# Altium schematic sheet 06_SAMA7G54-DDR3.SchDoc
size 420 x 297 mm; SheetNumber: 29; SheetTotal: 29
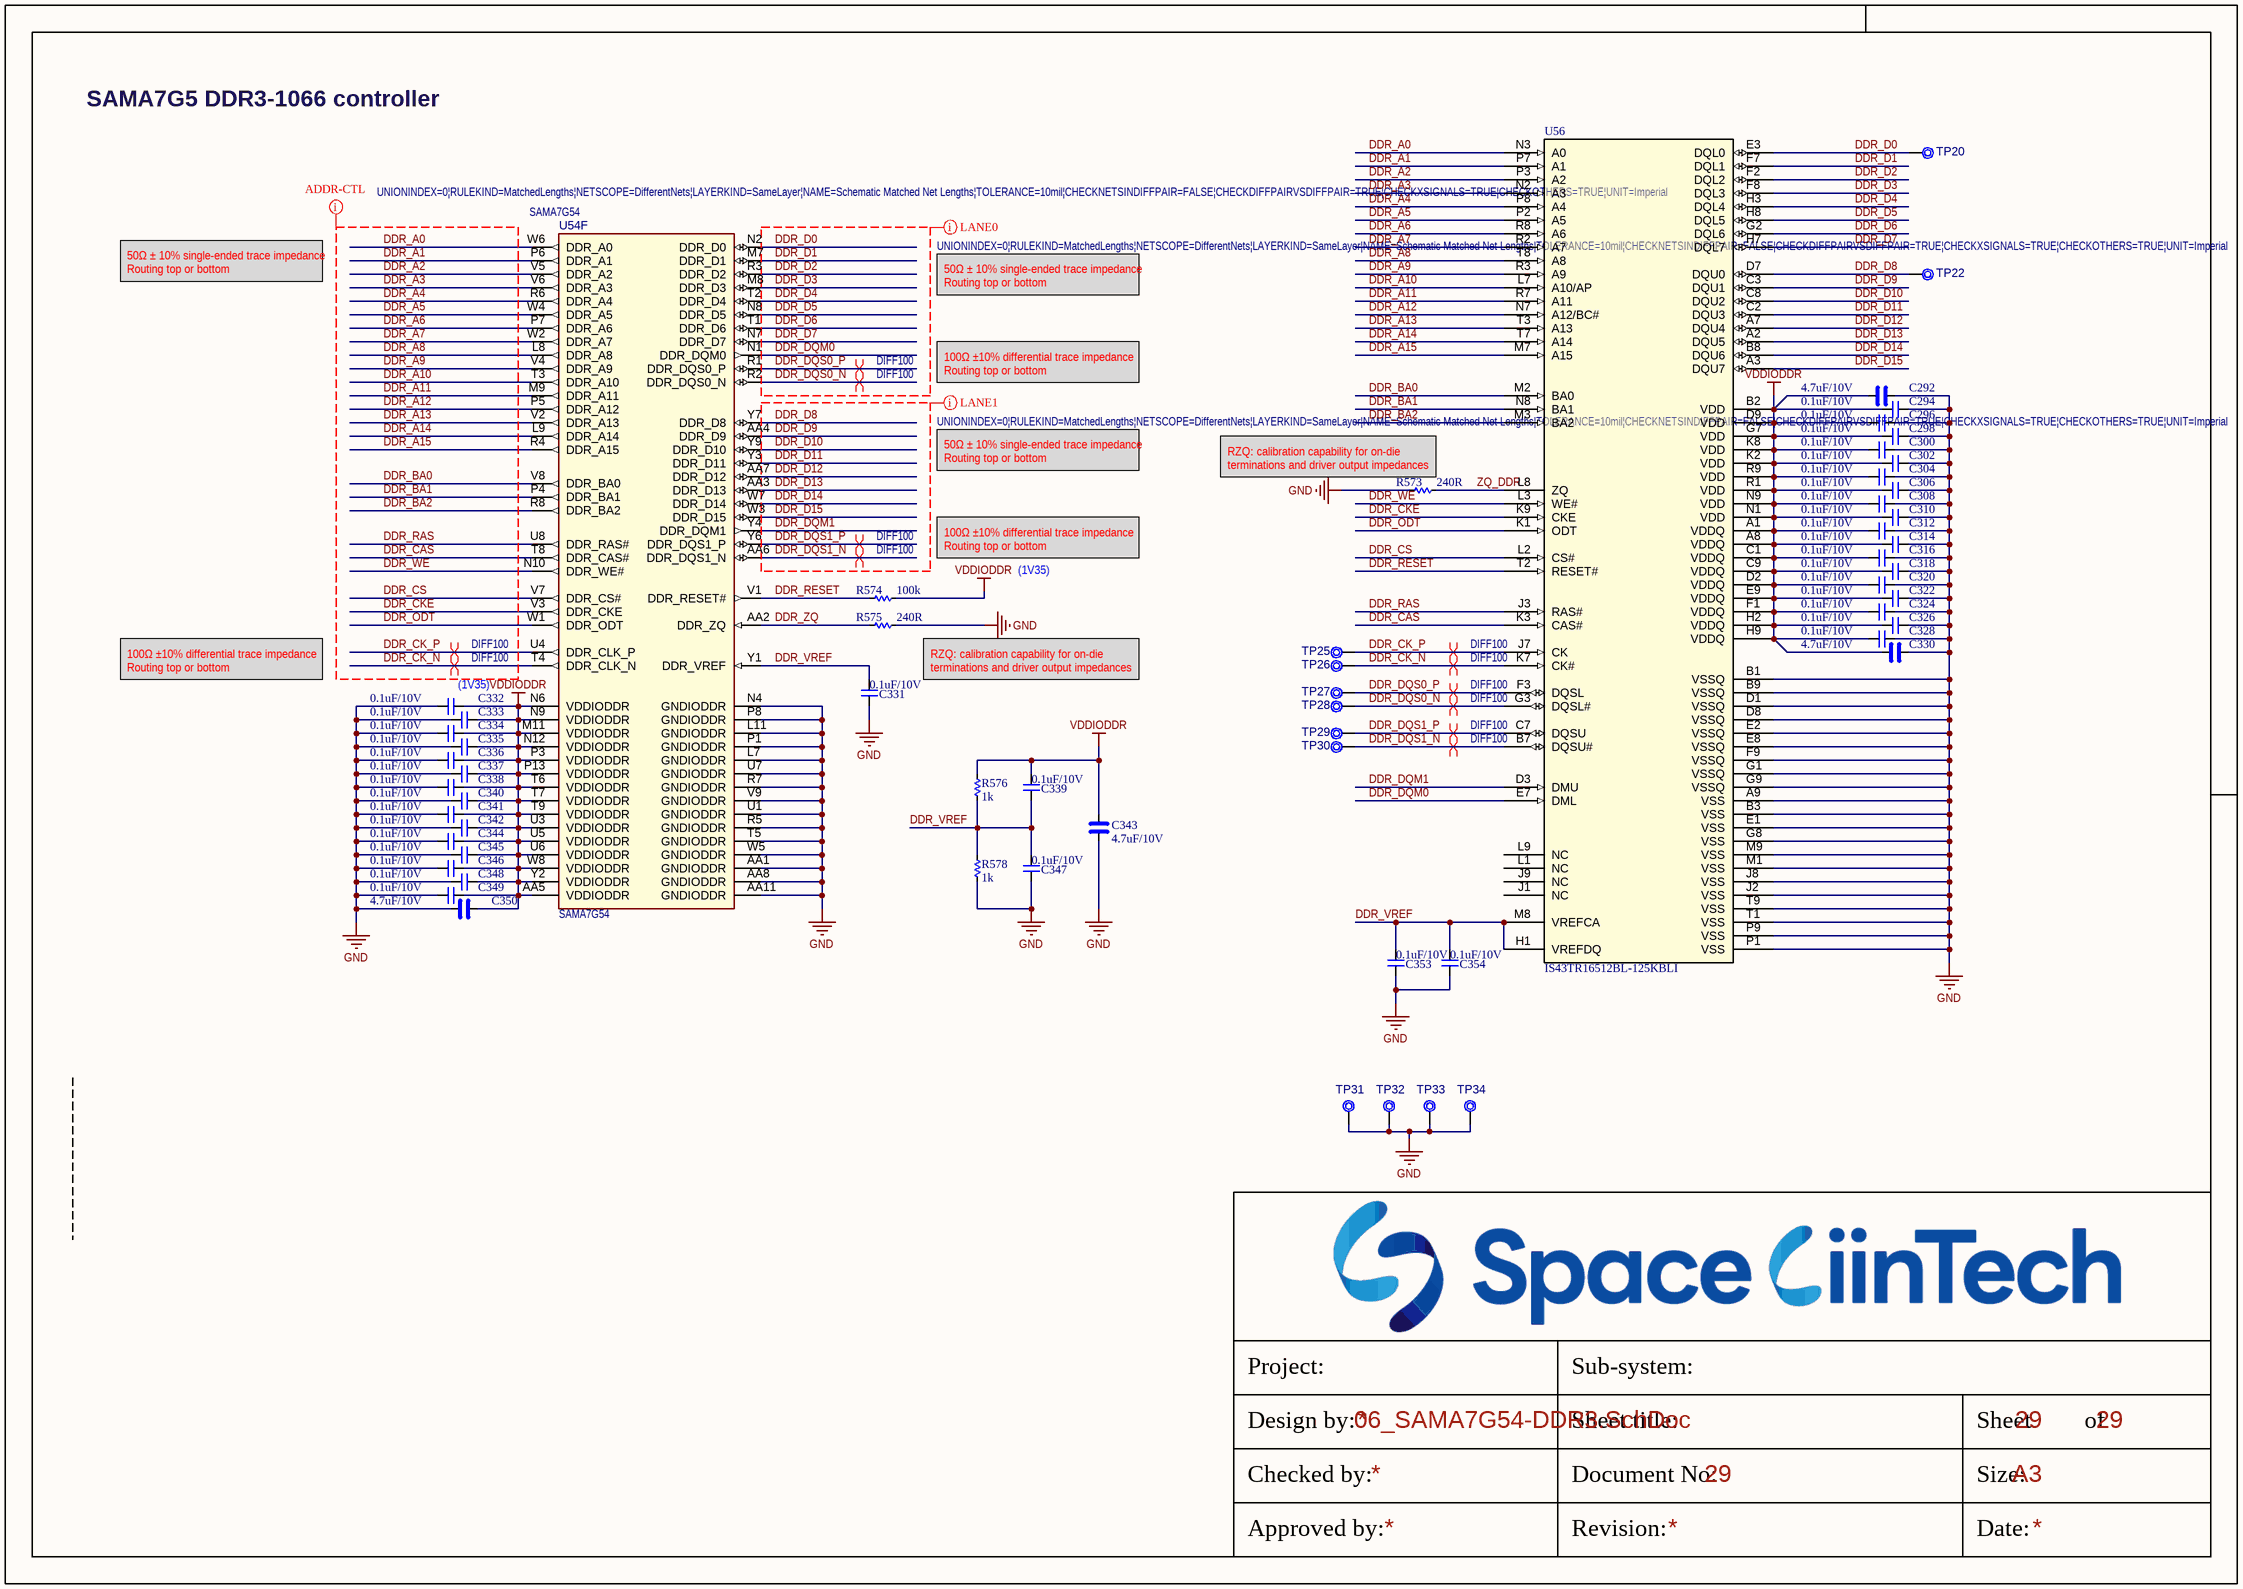
[diagram p0: 06_SAMA7G54-DDR3.SchDoc]

## Parts
C292  4.7uF/10V  [CAP_C_1005X50_L]
C294  0.1uF/10V  [CAP_C_0603x30]
C296  0.1uF/10V  [CAP_C_0603x30]
C298  0.1uF/10V  [CAP_C_0603x30]
C300  0.1uF/10V  [CAP_C_0603x30]
C302  0.1uF/10V  [CAP_C_0603x30]
C304  0.1uF/10V  [CAP_C_0603x30]
C306  0.1uF/10V  [CAP_C_0603x30]
C308  0.1uF/10V  [CAP_C_0603x30]
C310  0.1uF/10V  [CAP_C_0603x30]
C312  0.1uF/10V  [CAP_C_0603x30]
C314  0.1uF/10V  [CAP_C_0603x30]
C316  0.1uF/10V  [CAP_C_0603x30]
C318  0.1uF/10V  [CAP_C_0603x30]
C320  0.1uF/10V  [CAP_C_0603x30]
C322  0.1uF/10V  [CAP_C_0603x30]
C324  0.1uF/10V  [CAP_C_0603x30]
C326  0.1uF/10V  [CAP_C_0603x30]
C328  0.1uF/10V  [CAP_C_0603x30]
C330  4.7uF/10V  [CAP_C_1005X50_L]
C331  0.1uF/10V  [CAP_C_0603x30]
C332  0.1uF/10V  [CAP_C_0603x30]
C333  0.1uF/10V  [CAP_C_0603x30]
C334  0.1uF/10V  [CAP_C_0603x30]
C335  0.1uF/10V  [CAP_C_0603x30]
C336  0.1uF/10V  [CAP_C_0603x30]
C337  0.1uF/10V  [CAP_C_0603x30]
C338  0.1uF/10V  [CAP_C_0603x30]
C339  0.1uF/10V  [CAP_C_0603x30]
C340  0.1uF/10V  [CAP_C_0603x30]
C341  0.1uF/10V  [CAP_C_0603x30]
C342  0.1uF/10V  [CAP_C_0603x30]
C343  4.7uF/10V  [CAP_C_1005X60]
C344  0.1uF/10V  [CAP_C_0603x30]
C345  0.1uF/10V  [CAP_C_0603x30]
C346  0.1uF/10V  [CAP_C_0603x30]
C347  0.1uF/10V  [CAP_C_0603x30]
C348  0.1uF/10V  [CAP_C_0603x30]
C349  0.1uF/10V  [CAP_C_0603x30]
C350  4.7uF/10V  [CAP_C_1005X50_L]
C353  0.1uF/10V  [CAP_C_0603x30]
C354  0.1uF/10V  [CAP_C_0603x30]
R573  240R  [RES_C_0603X30]
R574  100k  [RES_C_0603X30]
R575  240R  [RES_C_0603X30]
R576  1k  [RES_C_0603X30]
R578  1k  [RES_C_0603X30]
TP20  Test Point No BOM  [Testpoint_80]  (value not drawn)  (no BOM)
TP22  Test Point No BOM  [Testpoint_80]  (value not drawn)  (no BOM)
TP25  Test Point No BOM  [Testpoint_80]  (value not drawn)  (no BOM)
TP26  Test Point No BOM  [Testpoint_80]  (value not drawn)  (no BOM)
TP27  Test Point No BOM  [Testpoint_80]  (value not drawn)  (no BOM)
TP28  Test Point No BOM  [Testpoint_80]  (value not drawn)  (no BOM)
TP29  Test Point No BOM  [Testpoint_80]  (value not drawn)  (no BOM)
TP30  Test Point No BOM  [Testpoint_80]  (value not drawn)  (no BOM)
TP31  Test Point No BOM  [Testpoint_80]  (value not drawn)  (no BOM)
TP32  Test Point No BOM  [Testpoint_80]  (value not drawn)  (no BOM)
TP33  Test Point No BOM  [Testpoint_80]  (value not drawn)  (no BOM)
TP34  Test Point No BOM  [Testpoint_80]  (value not drawn)  (no BOM)
U54  SAMA7G54  [TFBGA-343_14x14]  (part F of 8)
U56  IS43TR16512BL-125KBLI  [TWBGA96_ISI]

## Nets
GND: C292.1 C294.1 C296.1 C298.1 C300.1 C302.1 C304.1 C306.1 C308.1 C310.1 C312.1 C314.1 C316.1 C318.1 C320.1 C322.1 C324.1 C326.1 C328.1 C330.1 C331.2 C332.2 C333.2 C334.2 C335.2 C336.2 C337.2 C338.2 C340.2 C341.2 C342.2 C343.2 C344.2 C345.2 C346.2 C347.2 C348.2 C349.2 C350.2 C353.2 C354.2 R573.2 R575.1 R578.2 TP31.1 TP32.1 TP33.1 TP34.1 U54.AA1(GNDIODDR) U54.AA8(GNDIODDR) U54.AA11(GNDIODDR) U54.L7(GNDIODDR) U54.L11(GNDIODDR) U54.N4(GNDIODDR) U54.P1(GNDIODDR) U54.P8(GNDIODDR) U54.R5(GNDIODDR) U54.R7(GNDIODDR) U54.T5(GNDIODDR) U54.U1(GNDIODDR) U54.U7(GNDIODDR) U54.V9(GNDIODDR) U54.W5(GNDIODDR) U56.A9(VSS) U56.B1(VSSQ) U56.B3(VSS) U56.B9(VSSQ) U56.D1(VSSQ) U56.D8(VSSQ) U56.E1(VSS) U56.E2(VSSQ) U56.E8(VSSQ) U56.F9(VSSQ) U56.G1(VSSQ) U56.G8(VSS) U56.G9(VSSQ) U56.J2(VSS) U56.J8(VSS) U56.M1(VSS) U56.M9(VSS) U56.P1(VSS) U56.P9(VSS) U56.T1(VSS) U56.T9(VSS)
VDDIODDR: C292.2 C294.2 C296.2 C298.2 C300.2 C302.2 C304.2 C306.2 C308.2 C310.2 C312.2 C314.2 C316.2 C318.2 C320.2 C322.2 C324.2 C326.2 C328.2 C330.2 C332.1 C333.1 C334.1 C335.1 C336.1 C337.1 C338.1 C339.1 C340.1 C341.1 C342.1 C343.1 C344.1 C345.1 C346.1 C348.1 C349.1 C350.1 R574.1 R576.1 U54.AA5(VDDIODDR) U54.M11(VDDIODDR) U54.N6(VDDIODDR) U54.N9(VDDIODDR) U54.N12(VDDIODDR) U54.P3(VDDIODDR) U54.P13(VDDIODDR) U54.T6(VDDIODDR) U54.T7(VDDIODDR) U54.T9(VDDIODDR) U54.U3(VDDIODDR) U54.U5(VDDIODDR) U54.U6(VDDIODDR) U54.W8(VDDIODDR) U54.Y2(VDDIODDR) U56.A1(VDDQ) U56.A8(VDDQ) U56.B2(VDD) U56.C1(VDDQ) U56.C9(VDDQ) U56.D2(VDDQ) U56.D9(VDD) U56.E9(VDDQ) U56.F1(VDDQ) U56.G7(VDD) U56.H2(VDDQ) U56.H9(VDDQ) U56.K2(VDD) U56.K8(VDD) U56.N1(VDD) U56.N9(VDD) U56.R1(VDD) U56.R9(VDD)
DDR_A0: U54.W6(DDR_A0) U56.N3(A0)
DDR_A1: U54.P6(DDR_A1) U56.P7(A1)
DDR_A2: U54.V5(DDR_A2) U56.P3(A2)
DDR_A3: U54.V6(DDR_A3) U56.N2(A3)
DDR_A4: U54.R6(DDR_A4) U56.P8(A4)
DDR_A5: U54.W4(DDR_A5) U56.P2(A5)
DDR_A6: U54.P7(DDR_A6) U56.R8(A6)
DDR_A7: U54.W2(DDR_A7) U56.R2(A7)
DDR_A8: U54.L8(DDR_A8) U56.T8(A8)
DDR_A9: U54.V4(DDR_A9) U56.R3(A9)
DDR_A10: U54.T3(DDR_A10) U56.L7(A10/AP)
DDR_A11: U54.M9(DDR_A11) U56.R7(A11)
DDR_A12: U54.P5(DDR_A12) U56.N7(A12/BC#)
DDR_A13: U54.V2(DDR_A13) U56.T3(A13)
DDR_A14: U54.L9(DDR_A14) U56.T7(A14)
DDR_A15: U54.R4(DDR_A15) U56.M7(A15)
DDR_BA0: U54.V8(DDR_BA0) U56.M2(BA0)
DDR_BA1: U54.P4(DDR_BA1) U56.N8(BA1)
DDR_BA2: U54.R8(DDR_BA2) U56.M3(BA2)
DDR_CAS: U54.T8(DDR_CAS#) U56.K3(CAS#)
DDR_CK_N: TP26.1 U54.T4(DDR_CLK_N) U56.K7(CK#)
DDR_CK_P: TP25.1 U54.U4(DDR_CLK_P) U56.J7(CK)
DDR_CKE: U54.V3(DDR_CKE) U56.K9(CKE)
DDR_CS: U54.V7(DDR_CS#) U56.L2(CS#)
DDR_D0: TP20.1 U54.N2(DDR_D0) U56.E3(DQL0)
DDR_D1: U54.M7(DDR_D1) U56.F7(DQL1)
DDR_D2: U54.R3(DDR_D2) U56.F2(DQL2)
DDR_D3: U54.M8(DDR_D3) U56.F8(DQL3)
DDR_D4: U54.T2(DDR_D4) U56.H3(DQL4)
DDR_D5: U54.N8(DDR_D5) U56.H8(DQL5)
DDR_D6: U54.T1(DDR_D6) U56.G2(DQL6)
DDR_D7: U54.N7(DDR_D7) U56.H7(DQL7)
DDR_D8: TP22.1 U54.Y7(DDR_D8) U56.D7(DQU0)
DDR_D9: U54.AA4(DDR_D9) U56.C3(DQU1)
DDR_D10: U54.Y9(DDR_D10) U56.C8(DQU2)
DDR_D11: U54.Y3(DDR_D11) U56.C2(DQU3)
DDR_D12: U54.AA7(DDR_D12) U56.A7(DQU4)
DDR_D13: U54.AA3(DDR_D13) U56.A2(DQU5)
DDR_D14: U54.W7(DDR_D14) U56.B8(DQU6)
DDR_D15: U54.W3(DDR_D15) U56.A3(DQU7)
DDR_DQM0: U54.N1(DDR_DQM0) U56.E7(DML)
DDR_DQM1: U54.Y4(DDR_DQM1) U56.D3(DMU)
DDR_DQS0_N: TP28.1 U54.R2(DDR_DQS0_N) U56.G3(DQSL#)
DDR_DQS0_P: TP27.1 U54.R1(DDR_DQS0_P) U56.F3(DQSL)
DDR_DQS1_N: TP30.1 U54.AA6(DDR_DQS1_N) U56.B7(DQSU#)
DDR_DQS1_P: TP29.1 U54.Y6(DDR_DQS1_P) U56.C7(DQSU)
DDR_ODT: U54.W1(DDR_ODT) U56.K1(ODT)
DDR_RAS: U54.U8(DDR_RAS#) U56.J3(RAS#)
DDR_RESET: R574.2 U54.V1(DDR_RESET#) U56.T2(RESET#)
DDR_VREF: C331.1 C339.2 C347.1 C353.1 C354.1 R576.2 R578.1 U54.Y1(DDR_VREF) U56.H1(VREFDQ) U56.M8(VREFCA)
DDR_WE: U54.N10(DDR_WE#) U56.L3(WE#)
DDR_ZQ: R575.2 U54.AA2(DDR_ZQ)
ZQ_DDR: R573.1 U56.L8(ZQ)

Not connected (* = marked no-connect by the designer): U56 J1(NC) J9(NC) L1(NC) L9(NC)

## Layout directives
net class DDR-LANE0; rule Matched Net Lengths [Tolerance = 10mil]: DDR_D0, DDR_D1, DDR_D2, DDR_D3, DDR_D4, DDR_D5, DDR_D6, DDR_D7, DDR_DQM0, DDR_DQS0_N, DDR_DQS0_P
net class DDR-LANE1; rule Matched Net Lengths [Tolerance = 10mil]: DDR_D8, DDR_D9, DDR_D10, DDR_D11, DDR_D12, DDR_D13, DDR_D14, DDR_D15, DDR_DQM1, DDR_DQS1_N, DDR_DQS1_P
net class DDR-ADDR-CTL; rule Matched Net Lengths [Tolerance = 10mil]: DDR_A0, DDR_A1, DDR_A2, DDR_A3, DDR_A4, DDR_A5, DDR_A6, DDR_A7, DDR_A8, DDR_A9, DDR_A10, DDR_A11, DDR_A12, DDR_A13, DDR_A14, DDR_A15, DDR_BA0, DDR_BA1, DDR_BA2, DDR_CAS, DDR_CK_N, DDR_CK_P, DDR_CKE, DDR_CS, DDR_ODT, DDR_RAS, DDR_WE
differential pair; differential pair class DIFF100; net class DIFF100; rule Matched Net Lengths [Tolerance = 4mil]: DDR_CK_N, DDR_CK_P, DDR_DQS0_N, DDR_DQS0_P, DDR_DQS1_N, DDR_DQS1_P

## Notes on the sheet
- SAMA7G5 DDR3-1066 controller
- 50Ω ± 10% single-ended trace impedance
  Routing top or bottom
- 100Ω ±10% differential trace impedance
  Routing top or bottom
- (near R573) RZQ: calibration capability for on-die terminations and driver output impedances
- (1V35)
- (near C332) (1V35)
- RZQ: calibration capability for on-die terminations and driver output impedances
- Project:
- Sub-system:
- Design by:
- Sheet title:
- Sheet
- of
- Checked by:
- Approved by:
- Revision:
- Document No:
- Size:
- Date:
- A3

## Library data of the parts
C292 C330 C343 C350 = _CAP_C_High_2: CAP CHIP High Value
C294 C296 C298 C300 C302 C304 C306 C308 C310 C312 C314 C316 C318 C320 C322 C324 C326 C328 C331-C342 C344-C349 C353 C354 = _CAP_C_2: CAP CHIP
R573-R576 R578 = _RES_B_2: RES
TP20 TP22 TP25-TP34 = CON1759: Test Point; Value: TP PAD PCB 1mm; Description_: CON TP PAD PCB 1mm SMD; Dev Tools Status: Design; Owner: Cristian Papuc; Populated: YES; MCHP-ID: CON1759; Revision: A; Symbol: Test Point No BOM; Status: MCL Design; ComponentLink1Description: SVN Datasheet; ComponentLink2Description: Local Datasheet; ComponentLink3URL: C:\ALTIUM_WORK\00001_MCHP-CDB\Library\LibraryRefs\Test Point No BOM.SchLib; ComponentLink3Description: Open Symbol; ComponentLink4URL: C:\ALTIUM_WORK\00001_MCHP-CDB\Library\Footprints\TP_1mm_SMD.PcbLib; ComponentLink4Description: Open Footprint; ComponentLink5Description: Open Footprint 2; ComponentLink6Description: Open Footprint 3; ComponentLink7Description: Open Footprint 4; Type: Test Point; Category: Connector; Quantity Override: 1
U54 = MIC8923: SAMA7G54 MPU 1000MHz Cortex-A7 TFBGA-343; Manufacturer Part Number 1: SAMA7G54-V/4HB; Manufacturer 1: Microchip; Description_: MCHP MPU 32-BIT Cortex-A7 1000MHz 128kB SAMA7G54-V/4HB TFBGA-343; Populated: YES; Dev Tools Status: Design; Owner: Ciprian Abramov; Package: TFBGA-343; MCHP-ID: MIC8923; Value: SAMA7G54; Symbol: SAMA7G54 TFBGA-343; Type: 32-Bit MPU; Status: MCL Design; Revision: 1; Category: MCHP-Microcontroller; ComponentLink1Description: SVN Datasheet; ComponentLink2Description: Local Datasheet; ComponentLink3URL: C:\ALTIUM_WORK\00001_MCHP-CDB\Library\LibraryRefs\SAMA7G54 TFBGA-343.SchLib; ComponentLink3Description: Open Symbol; ComponentLink4URL: C:\ALTIUM_WORK\00001_MCHP-CDB\Library\Footprints\TFBGA-343_14x14.PcbLib; ComponentLink4Description: Open Footprint; ComponentLink5Description: Open Footprint 2; ComponentLink6Description: Open Footprint 3; ComponentLink7Description: Open Footprint 4; Supplier 1: Microchip; Supplier Part Number 1: SAMA7G54-V/4HB; Quantity Override: 1
U56 = IC_RAM_IS43TR16512BL-125KBLI: DDR3L; Manufacturer_Name: ISSI; Copyright: Copyright (C) 2025 Ultra Librarian. All rights reserved.; Manufacturer_Part_Number: IS43TR16512BL-125KBLI; RefDes: RefDes; Type: Type